# Altium project Hexapod_motherboard.PrjPcb
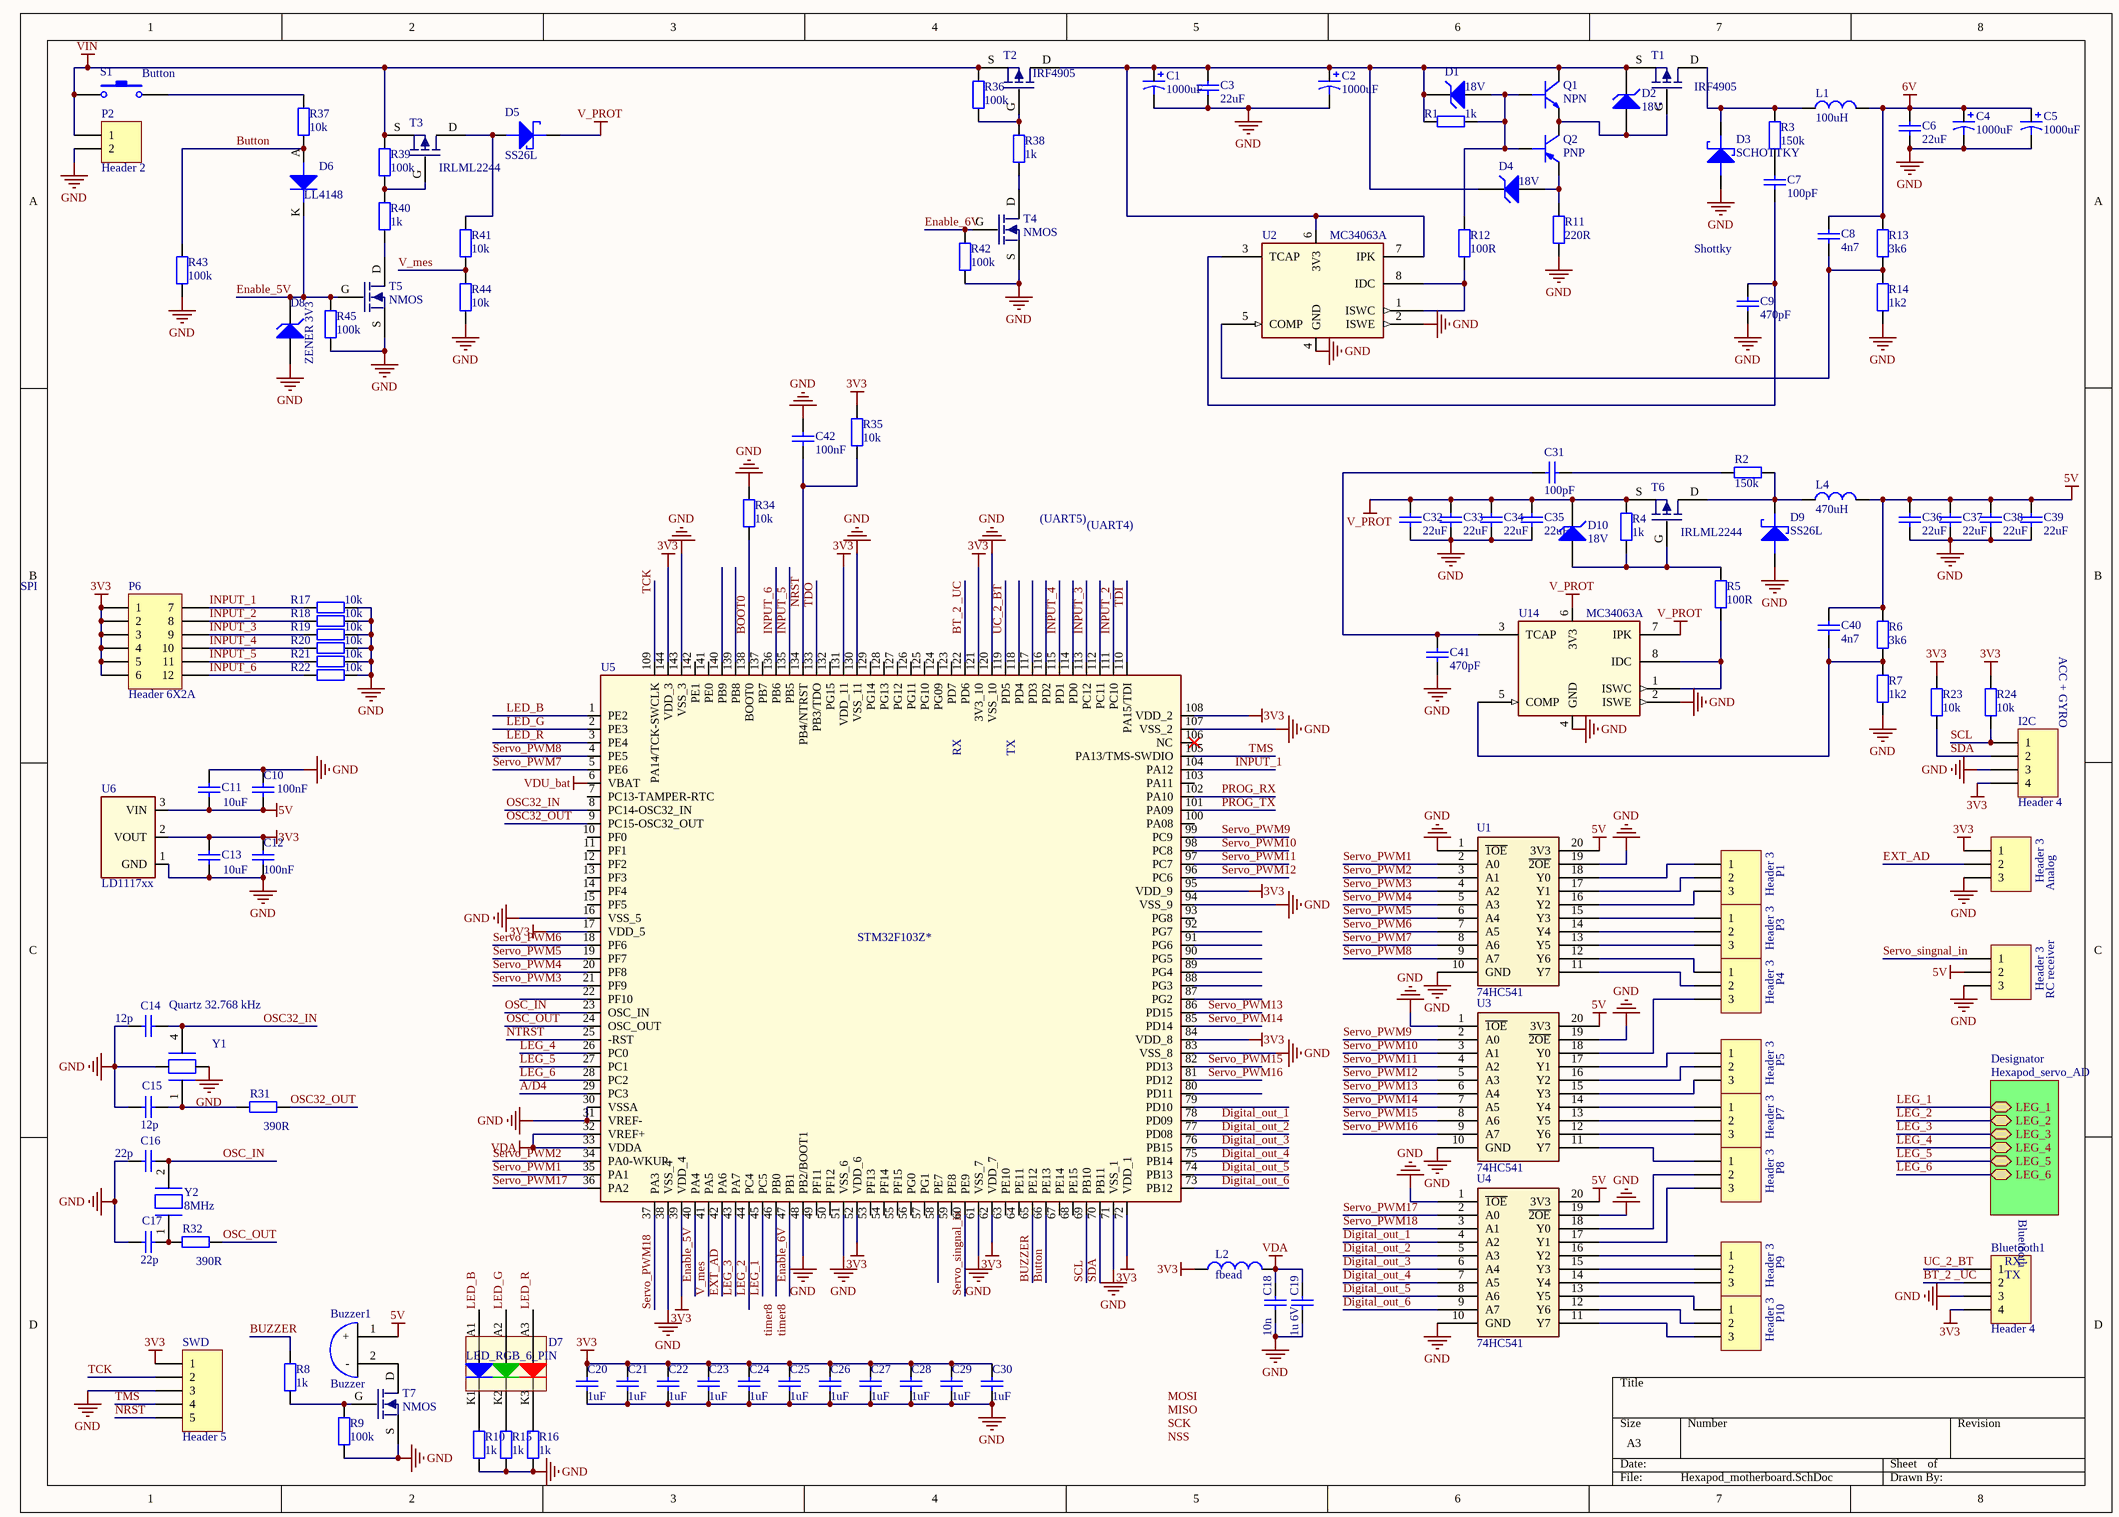
[diagram p0: Hexapod_motherboard.SchDoc]
2 sheets, 190 parts. Net scope: hierarchical (ports join the sheet entries above them; power ports are global).
Board file: Hexapod_motherboard.PcbDoc
Sheets:
  Hexapod_motherboard.SchDoc
    Designator = Hexapod_servo_AD.SchDoc

## Sheet Hexapod_motherboard.SchDoc
size A3

### Parts
Analog  Header 3  [HDR1X3]
Bluetooth1  Header 4  [HDR1X4]
Buzzer1  Buzzer  [SMD Buzzer]
C1  1000uF  [cap_10x12]
C2  1000uF  [cap_10x12]
C3  22uF  [FP_1210_CAP_N]
C4  1000uF  [cap_10x12]
C5  1000uF  [cap_10x12]
C6  22uF  [FP_1210_CAP_N]
C7  100pF  [FP_0603_CAP_080]
C8  4n7  [FP_0603_CAP_080]
C9  470pF  [FP_0603_CAP_080]
C10  100nF  [FP_0603_CAP_080]
C11  10uF  [FP_1206_CAP_085]
C12  100nF  [FP_0603_CAP_080]
C13  10uF  [FP_1206_CAP_085]
C14  12p  [FP_0603_CAP_080]
C15  12p  [FP_0603_CAP_080]
C16  22p  [FP_0603_CAP_080]
C17  22p  [FP_0603_CAP_080]
C18  10n  [FP_0603_CAP_080]
C19  1u 6V  [FP_0603_CAP_080]
C20  1uF  [FP_0603_CAP_080]
C21  1uF  [FP_0603_CAP_080]
C22  1uF  [FP_0603_CAP_080]
C23  1uF  [FP_0603_CAP_080]
C24  1uF  [FP_0603_CAP_080]
C25  1uF  [FP_0603_CAP_080]
C26  1uF  [FP_0603_CAP_080]
C27  1uF  [FP_0603_CAP_080]
C28  1uF  [FP_0603_CAP_080]
C29  1uF  [FP_0603_CAP_080]
C30  1uF  [FP_0603_CAP_080]
C31  100pF  [FP_0603_CAP_080]
C32  22uF  [C1210_N]
C33  22uF  [C1210_N]
C34  22uF  [C1210_N]
C35  22uF  [C1210_N]
C36  22uF  [C1210_N]
C37  22uF  [C1210_N]
C38  22uF  [C1210_N]
C39  22uF  [C1210_N]
C40  4n7  [FP_0603_CAP_080]
C41  470pF  [FP_0603_CAP_080]
C42  100nF  [FP_0603_CAP_080]
D1  18V  [SOD-80]
D2  18V  [SOD-80]
D3  SCHOTTKY  [DIODE_TO220]
D4  18V  [SOD-80]
D5  SS26L  [subsma]
D6  LL4148  [SOD-80]
D7  LED_RGB_6_PIN  [LED_PLCC-6]
D8  ZENER 3V3  [sod-80]
D9  SS26L  [subsma]
D10  18V  [SOD-80]
I2C  Header 4  [HDR1X4]
L1  100uH  [SRR1206_T]
L2  fbead  [FP_0603_IND]
L4  470uH  [INDUCTOR_6,6X6,6mm]
P1  Header 3  [HDR1X3]
P2  Header 2  [Sorkapocs 2P 5mm]
P3  Header 3  [HDR1X3]
P4  Header 3  [HDR1X3]
P5  Header 3  [HDR1X3]
P6  Header 6X2A  [HDR2X6_CEN]
P7  Header 3  [HDR1X3]
P8  Header 3  [HDR1X3]
P9  Header 3  [HDR1X3]
P10  Header 3  [HDR1X3]
Q1  NPN  [TR_SOT23]
Q2  PNP  [TR_SOT23]
R1  1k  [FP_1206_RES]
R2  150k  [FP_0603_RES]
R3  150k  [FP_0603_RES]
R4  1k  [FP_0603_RES]
R5  100R  [FP_0603_RES]
R6  3k6  [FP_0603_RES]
R7  1k2  [FP_0603_RES]
R8  1k  [FP_0603_RES]
R9  100k  [FP_0603_RES]
R10  1k  [FP_0603_RES]
R11  220R  [FP_1206_RES]
R12  100R  [FP_1206_RES]
R13  3k6  [FP_0603_RES]
R14  1k2  [FP_0603_RES]
R15  1k  [FP_0603_RES]
R16  1k  [FP_0603_RES]
R17  10k  [FP_0603_RES]
R18  10k  [FP_0603_RES]
R19  10k  [FP_0603_RES]
R20  10k  [FP_0603_RES]
R21  10k  [FP_0603_RES]
R22  10k  [FP_0603_RES]
R23  10k  [FP_0603_RES]
R24  10k  [FP_0603_RES]
R31  390R  [FP_0603_RES]
R32  390R  [FP_0603_RES]
R34  10k  [FP_0603_RES]
R35  10k  [FP_0603_RES]
R36  100k  [FP_0603_RES]
R37  10k  [FP_0603_RES]
R38  1k  [FP_0603_RES]
R39  100k  [FP_0603_RES]
R40  1k  [FP_0603_RES]
R41  10k  [FP_0603_RES]
R42  100k  [FP_0603_RES]
R43  100k  [FP_0603_RES]
R44  10k  [FP_0603_RES]
R45  100k  [FP_0603_RES]
RC_receiver  Header 3  [HDR1X3]
S1  Button  [BUTTON_6X6 _SMD]
SWD  Header 5  [HDR1X5]
T1  IRF4905  [FET_TO220]
T2  IRF4905  [FET_TO220]
T3  IRLML2244  [FET_SOT23]
T4  NMOS  [FET_SOT23]
T5  NMOS  [FET_SOT23]
T6  IRLML2244  [FET_SOT23]
T7  NMOS  [FET_SOT23]
U1  74HC541  [DIGITAL_SOIC20W]
U2  MC34063A  [FP_SO8_MS012AA]
U3  74HC541  [DIGITAL_SOIC20W]
U4  74HC541  [DIGITAL_SOIC20W]
U5  STM32F103Z*  [LQFP144]
U6  LD1117xx  [SUPPLY_SOT223]
U14  MC34063A  [FP_SO8_MS012AA]
Y1  Quartz 32.768 kHz  [XTAL_ABS25]
Y2  value 8MHz  [FP_CRYSTAL_HC49_SMD]  (hidden comment: 8MHz Quartz HC49)

### Sub-sheets
Designator = Hexapod_servo_AD: LEG_1, LEG_2, LEG_3, LEG_4, LEG_5, LEG_6

### Nets
3V3: Analog.1 Bluetooth1.4 C12.1 C13.2 C20.2 C21.2 C22.2 C23.2 C24.2 C25.2 C26.2 C27.2 C28.2 C29.2 C30.2 I2C.4 L2.1 P6.1 P6.2 P6.3 P6.4 P6.5 P6.6 R23.2 R24.2 R35.2 SWD.1 U5.17(VDD_5) U5.39(VDD_4) U5.52(VDD_6) U5.62(VDD_7) U5.72(VDD_1) U5.84(VDD_8) U5.95(VDD_9) U5.108(VDD_2) U5.121(3V3_10) U5.131(VDD_11) U5.144(VDD_3) U6.2(VOUT)
5V: Buzzer1.1(+) C10.2 C11.1 C36.2 C37.2 C38.2 C39.2 C40.2 L4.2 R6.2 RC_receiver.2 U1.20(3V3) U3.20(3V3) U4.20(3V3) U6.3(VIN)
6V: C4.P C5.P C6.2 C8.2 L1.2 R13.2
GND: Analog.3 Bluetooth1.3 C1.N C2.N C3.1 C4.N C5.N C6.1 C9.2 C10.1 C11.2 C12.2 C13.1 C14.1 C15.1 C16.1 C17.1 C18.1 C19.1 C20.1 C21.1 C22.1 C23.1 C24.1 C25.1 C26.1 C27.1 C28.1 C29.1 C30.1 C32.1 C33.1 C34.1 C35.1 C36.1 C37.1 C38.1 C39.1 C41.2 C42.2 D3.A D8.A D9.A I2C.3 P2.2 R7.1 R9.1 R10.2 R11.1 R14.1 R15.2 R16.2 R17.2 R18.2 R19.2 R20.2 R21.2 R22.2 R34.2 R42.1 R43.2 R44.2 R45.1 RC_receiver.3 SWD.3 T4.S T5.S T7.S U1.1(~{1OE}) U1.10(GND) U1.19(~{2OE}) U2.2(ISWE) U2.4(GND) U3.1(~{1OE}) U3.10(GND) U3.19(~{2OE}) U4.1(~{1OE}) U4.10(GND) U4.19(~{2OE}) U5.16(VSS_5) U5.30(VSSA) U5.31(VREF-) U5.38(VSS_4) U5.48(PB2/BOOT1) U5.51(VSS_6) U5.61(VSS_7) U5.71(VSS_1) U5.83(VSS_8) U5.94(VSS_9) U5.107(VSS_2) U5.120(VSS_10) U5.130(VSS_11) U5.143(VSS_3) U6.1(GND) U14.2(ISWE) U14.4(GND) Y1.2 Y1.3
V_PROT: C32.2 C33.2 C34.2 C35.2 D5.K D10.K R4.2 T6.S U14.6(3V3) U14.7(IPK)
VDA: C18.2 C19.2 L2.2 U5.32(VREF+) U5.33(VDDA)
VDU_bat: U5.6(VBAT)
VIN: P2.1 R36.2 R39.2 S1.1 T2.S T3.S
A/D4: U5.29(PC3)
BOOT0: R34.1 U5.138(BOOT0)
BT_2 _UC: Bluetooth1.2 U5.122(PD6)
Button: D6.A R37.2 R43.1 U5.66(PE13)
BUZZER: R8.1 U5.65(PE12)
Digital_out_1: U4.4(A2) U5.78(PD09)
Digital_out_2: U4.5(A3) U5.77(PD08)
Digital_out_3: U4.6(A4) U5.76(PB15)
Digital_out_4: U4.7(A5) U5.75(PB14)
Digital_out_5: U4.8(A6) U5.74(PB13)
Digital_out_6: U4.9(A7) U5.73(PB12)
Enable_5V: D6.K D8.K R45.2 T5.G U5.40(PA4)
Enable_6V: R42.2 T4.G U5.47(PB1)
EXT_AD: Analog.2 U5.42(PA6)
INPUT_1: P6.7 R17.1 U5.104(PA12)
INPUT_2: P6.8 R18.1 U5.111(PC10)
INPUT_3: P6.9 R19.1 U5.113(PC12)
INPUT_4: P6.10 R20.1 U5.115(PD1)
INPUT_5: P6.11 R21.1 U5.135(PB5)
INPUT_6: P6.12 R22.1 U5.136(PB6)
LED_B: D7.A1(A) U5.1(PE2)
LED_G: D7.A2(A) U5.2(PE3)
LED_R: D7.A3(A) U5.3(PE4)
LEG_1: U5.45(PC5) ; sheet Designator/LEG_1
LEG_2: U5.44(PC4) ; sheet Designator/LEG_2
LEG_3: U5.43(PA7) ; sheet Designator/LEG_3
LEG_4: U5.26(PC0) ; sheet Designator/LEG_4
LEG_5: U5.27(PC1) ; sheet Designator/LEG_5
LEG_6: U5.28(PC2) ; sheet Designator/LEG_6
NRST: C42.1 R35.1 SWD.5 U5.134(PB4/NTRST)
NTRST: U5.25(-RST)
OSC32_IN: C14.2 U5.8(PC14-OSC32_IN) Y1.4
OSC32_OUT: R31.1 U5.9(PC15-OSC32_OUT)
OSC_IN: C16.2 U5.23(OSC_IN) Y2.2
OSC_OUT: R32.1 U5.24(OSC_OUT)
PROG_RX: U5.102(PA10)
PROG_TX: U5.101(PA09)
SCL: I2C.1 R24.1 U5.69(PB10)
SDA: I2C.2 R23.1 U5.70(PB11)
Servo_PWM1: U1.2(A0) U5.35(PA1)
Servo_PWM2: U1.3(A1) U5.34(PA0-WKUP)
Servo_PWM3: U1.4(A2) U5.21(PF9)
Servo_PWM4: U1.5(A3) U5.20(PF8)
Servo_PWM5: U1.6(A4) U5.19(PF7)
Servo_PWM6: U1.7(A5) U5.18(PF6)
Servo_PWM7: U1.8(A6) U5.5(PE6)
Servo_PWM8: U1.9(A7) U5.4(PE5)
Servo_PWM9: U3.2(A0) U5.99(PC9)
Servo_PWM10: U3.3(A1) U5.98(PC8)
Servo_PWM11: U3.4(A2) U5.97(PC7)
Servo_PWM12: U3.5(A3) U5.96(PC6)
Servo_PWM13: U3.6(A4) U5.86(PD15)
Servo_PWM14: U3.7(A5) U5.85(PD14)
Servo_PWM15: U3.8(A6) U5.82(PD13)
Servo_PWM16: U3.9(A7) U5.81(PD12)
Servo_PWM17: U4.2(A0) U5.36(PA2)
Servo_PWM18: U4.3(A1) U5.37(PA3)
Servo_singnal_in: RC_receiver.1 U5.60(PE9)
TCK: SWD.2 U5.109(PA14/TCK-SWCLK)
TDI: U5.110(PA15/TDI)
TDO: U5.133(PB3/TDO)
TMS: SWD.4 U5.105(PA13/TMS-SWDIO)
UC_2_BT: Bluetooth1.1 U5.119(PD5)
V_mes: R41.2 R44.1 U5.41(PA5)
NetBuzzer1_2: Buzzer1.2(-) T7.D
NetC1_P: C1.P C2.P C3.2 D1.K D2.K D4.K Q1.C R1.2 T1.S T2.D U2.6(3V3) U2.7(IPK)
NetC7_1: C7.1 R3.2
NetC7_2: C7.2 C9.1 U2.3(TCAP)
NetC8_1: C8.1 R13.1 R14.2 U2.5(COMP)
NetC15_2: C15.2 R31.2 Y1.1
NetC17_2: C17.2 R32.2 Y2.1
NetC31_1: C31.1 R2.2
NetC31_2: C31.2 C41.1 U14.3(TCAP)
NetC40_1: C40.1 R6.1 R7.2 U14.5(COMP)
NetD1_A: D1.A Q1.B Q2.B R1.1 R12.2
NetD2_A: D2.A Q1.E Q2.C T1.G
NetD3_K: D3.K L1.1 R3.1 T1.D
NetD4_A: D4.A Q2.E R11.2
NetD5_A: D5.A R41.1 T3.D
NetD7_K1: D7.K1(R) R10.1
NetD7_K2: D7.K2(G) R15.1
NetD7_K3: D7.K3(B) R16.1
NetD9_K: D9.K L4.1 R2.1 T6.D
NetD10_A: D10.A R4.1 R5.2 T6.G
NetP1_1: P1.1 U1.18(Y0)
NetP1_2: P1.2 U1.17(Y1)
NetP1_3: P1.3 U1.16(Y2)
NetP3_1: P3.1 U1.15(Y3)
NetP3_2: P3.2 U1.14(Y4)
NetP3_3: P3.3 U1.13(Y5)
NetP4_1: P4.1 U1.12(Y6)
NetP4_2: P4.2 U1.11(Y7)
NetP4_3: P4.3 U3.18(Y0)
NetP5_1: P5.1 U3.17(Y1)
NetP5_2: P5.2 U3.16(Y2)
NetP5_3: P5.3 U3.15(Y3)
NetP7_1: P7.1 U3.14(Y4)
NetP7_2: P7.2 U3.13(Y5)
NetP7_3: P7.3 U3.12(Y6)
NetP8_1: P8.1 U3.11(Y7)
NetP8_2: P8.2 U4.18(Y0)
NetP8_3: P8.3 U4.17(Y1)
NetP9_1: P9.1 U4.16(Y2)
NetP9_2: P9.2 U4.15(Y3)
NetP9_3: P9.3 U4.14(Y4)
NetP10_1: P10.1 U4.13(Y5)
NetP10_2: P10.2 U4.12(Y6)
NetP10_3: P10.3 U4.11(Y7)
NetR5_1: R5.1 U14.1(ISWC) U14.8(IDC)
NetR8_2: R8.2 R9.2 T7.G
NetR12_1: R12.1 U2.1(ISWC) U2.8(IDC)
NetR36_1: R36.1 R38.2 T2.G
NetR37_1: R37.1 S1.2
NetR38_1: R38.1 T4.D
NetR39_1: R39.1 R40.1 T3.G
NetR40_2: R40.2 T5.D

Not connected (* = marked no-connect by the designer): U5 7(PC13-TAMPER-RTC) 10(PF0) 11(PF1) 12(PF2) 13(PF3) 14(PF4) 15(PF5) 22(PF10) 46(PB0) 49(PF11) 50(PF12) 53(PF13) 54(PF14) 55(PF15) 56(PG0) 57(PG1) 58(PE7) 59(PE8) 63(PE10) 64(PE11) 67(PE14) 68(PE15) 79(PD10) 80(PD11) 87(PG2) 88(PG3) 89(PG4) 90(PG5) 91(PG6) 92(PG7) 93(PG8) 100(PA08) 103(PA11) 106(NC)* 112(PC11) 114(PD0) 116(PD2) 117(PD3) 118(PD4) 123(PD7) 124(PG09) 125(PG10) 126(PG11) 127(PG12) 128(PG13) 129(PG14) 132(PG15) 137(PB7) 139(PB8) 140(PB9) 141(PE0) 142(PE1)

### Notes on the sheet
- Shottky
- (UART5)
- SPI
- (UART4)
- (near I2C) ACC + GYRO
- (near U5) RX
- (near U5) TX
- (near Bluetooth1) RX
- (near Bluetooth1) Bluetooth
- (near Bluetooth1) TX
- Labels drawn without touching a wire or pin: MISO, MOSI, NSS, SCK, timer8

### Library data of the parts
Analog P1 P3-P5 P7-P10 RC_receiver = Header 3: Header, 3-Pin; LatestRevisionDate: 17-Jul-2002; LatestRevisionNote: Re-released for DXP Platform.; Publisher: Altium Limited
Bluetooth1 I2C = Header 4: Header, 4-Pin; LatestRevisionDate: 17-Jul-2002; LatestRevisionNote: Re-released for DXP Platform.; Publisher: Altium Limited
C1 C2 C4 C5 = CAP_ELECT: Polarized Capacitor; Value: 1000uF
C3 C6 C32-C39 = CAP: Capacitor; Tûrés: 20% X7R; Value: 22uF; Order info: http://www.tme.eu/hu/details/cl32a226kojnnne/mlcc-smd-1210-kondenzatorok/samsung/
C7 C31 = Cap: Capacitor; Order info: L: 82-02-26; Tûrés: 10%; Published: 8-Jun-2000; LatestRevisionDate: 17-Jul-2002; LatestRevisionNote: Re-released for DXP Platform.; PackageReference: RAD-0.3; Publisher: Altium Limited; Value: 100pF
C8 C40 = Cap: Capacitor; Value: 100pF; Order info: TODO; Tûrés: 10%; Published: 8-Jun-2000; LatestRevisionDate: 17-Jul-2002; LatestRevisionNote: Re-released for DXP Platform.; PackageReference: RAD-0.3; Publisher: Altium Limited
C9 C41 = Cap: Capacitor; Value: 100pF; Tûrés: 10% NP0; Published: 8-Jun-2000; LatestRevisionDate: 17-Jul-2002; LatestRevisionNote: Re-released for DXP Platform.; PackageReference: RAD-0.3; Publisher: Altium Limited; Order info: 82-02-34
C10 C12 C14-C17 C42 = Cap: Capacitor; Order info: TODO; Tûrés: 10%; Published: 8-Jun-2000; LatestRevisionDate: 17-Jul-2002; LatestRevisionNote: Re-released for DXP Platform.; PackageReference: RAD-0.3; Publisher: Altium Limited
  C10 C12 C42: Value: 100nF
  C14 C15: Value: 12p
  C16 C17: Value: 22p
C11 C13 = Cap: Capacitor; Value: 100nF; Tûrés: 20% X7R; Order info: TODO; Published: 8-Jun-2000; LatestRevisionDate: 17-Jul-2002; LatestRevisionNote: Re-released for DXP Platform.; PackageReference: RAD-0.3; Publisher: Altium Limited; Order info: 82-07-81
C18 C19 = Cap: Capacitor; Value: 100nF; Published: 8-Jun-2000; LatestRevisionDate: 17-Jul-2002; LatestRevisionNote: Re-released for DXP Platform.; PackageReference: RAD-0.3; Publisher: Altium Limited
C20-C30 = Cap: Capacitor; Published: 8-Jun-2000; LatestRevisionDate: 17-Jul-2002; LatestRevisionNote: Re-released for DXP Platform.; PackageReference: RAD-0.3; Publisher: Altium Limited; Value: 1uF
D1 D2 D4 D10 = ZENER: Zener Diode; U_Z: 24; Order info: L: 85-01-29
D3 = SCHOTTKY: NXP - PMEG3020EJ,115 - SCHOTTKY RECT 30V 2A SOD323F; Supplier: Farnell 1757772
D5 D9 = SCHOTTKY: NXP - PMEG3020EJ,115 - SCHOTTKY RECT 30V 2A SOD323F; Order info: L: 83-02-21
D6 = DIODE_big
D8 = ZENER: Zener Diode; U_Z: 24
L1 L4 = L: Order info: RET: 77-01-48  // lomex: 93-03-38
L2 = Inductor: Code_IEC: 1005; Published: 8-Jun-2000; LatestRevisionDate: 17-Jul-2002; LatestRevisionNote: Re-released for DXP Platform.; PackageReference: 0402-A; Publisher: Altium Limited; Code_JEITA: 0402; Value: FBEAD
P2 = Header 2: Header, 2-Pin; LatestRevisionDate: 17-Jul-2002; LatestRevisionNote: Re-released for DXP Platform.; Publisher: Altium Limited
P6 = Header 6X2A: Header, 6-Pin, Dual row; LatestRevisionDate: 17-Jul-2002; LatestRevisionNote: Re-released for DXP Platform.; Publisher: Altium Limited
R1 R4 = Res3: Resistor; Order info: TODO; Tûrés: 5%; Published: 8-Jun-2000; LatestRevisionDate: 04-Mar-2005; LatestRevisionNote: PCB Footprint replaced.; PackageReference: J1-0603; Publisher: Altium Limited; Value: 1k
R2 R3 R5 R11 R12 R34 R35 = Res3: Resistor; Value: 1k; Order info: TODO; Tûrés: 5%; Published: 8-Jun-2000; LatestRevisionDate: 04-Mar-2005; LatestRevisionNote: PCB Footprint replaced.; PackageReference: J1-0603; Publisher: Altium Limited
R6 R7 R13 R14 R23 R24 = Res3: Resistor; Value: 1k; Tûrés: 1%; Published: 8-Jun-2000; LatestRevisionDate: 04-Mar-2005; LatestRevisionNote: PCB Footprint replaced.; PackageReference: J1-0603; Publisher: Altium Limited
  R6 R13: Order info: 80-14-47
  R7 R14 R23 R24: Order info: 80-13-54
R8 R10 R15 R16 R38 R40 = Res3: Resistor; Published: 8-Jun-2000; LatestRevisionDate: 04-Mar-2005; LatestRevisionNote: PCB Footprint replaced.; PackageReference: J1-0603; Publisher: Altium Limited; Value: 1k
R9 R17-R22 R36 R37 R39 R41-R45 = Res3: Resistor; Value: 1k; Published: 8-Jun-2000; LatestRevisionDate: 04-Mar-2005; LatestRevisionNote: PCB Footprint replaced.; PackageReference: J1-0603; Publisher: Altium Limited
R31 R32 = Res3: Resistor; Value: 390; Order info: TODO; Tûrés: 5%; Published: 8-Jun-2000; LatestRevisionDate: 04-Mar-2005; LatestRevisionNote: PCB Footprint replaced.; PackageReference: J1-0603; Publisher: Altium Limited
S1 = SW-PB: Switch; Published: 24-Mar-1999; LatestRevisionDate: 17-Jul-2002; LatestRevisionNote: Re-released for DXP Platform.; PackageReference: SPST-2; Publisher: Altium Limited; Order info: http://www.tme.eu/hu/details/tactm-67n-f/tact-pcb-mikrokapcsolok/ninigi/#
SWD = Header 5: Header, 5-Pin; LatestRevisionDate: 17-Jul-2002; LatestRevisionNote: Re-released for DXP Platform.; Publisher: Altium Limited
T1 T2 = PMOS: Order info: mouser: 512-NDT2955
T3 T6 = PMOS
U1 U3 U4 = 74HC541: Octal buffer 3-state line driver
U2 U14 = MC34063A: Order info: mouser: 595-MC34063ADR
U5 = STM32F103Zxxx
U6 = LD1117xx: LD1117xx 3,3V lin reg; Order info: TODO; Order info: http://hu.mouser.com/ProductDetail/NXP/NX1117C33Z115/?qs=%2fha2pyFadui8%252bOpsKr9N%2fhvfdxjCMx%252bF0NTwqG%252bWOJY%3d
Y1 = XTAL_32,768khz ABS25 SMD: Order info: ugyanaz mint a feden
Y2 = XTAL HC49: Standard HC49 quartz; Manufacturer: Siward; Order info: ugyanaz mint a feden
Buzzer1 = Buzzer: Order info: http://www.digikey.com/product-detail/en/CD-1206-SMT/102-1150-ND/412409; Comment_1: Buzzer
D7 = LED_RGB_6_PIN: Order info: http://it.mouser.com/ProductDetail/OSRAM-Opto-Semiconductors/LRTBGFTM-ST7-1+VV9-29+Q5R/?qs=sGAEpiMZZMvyj6n1w4pZD%2ffl%252b8TIkxpNpOowvvOydA0%3d

## Sheet Hexapod_servo_AD.SchDoc
size A4
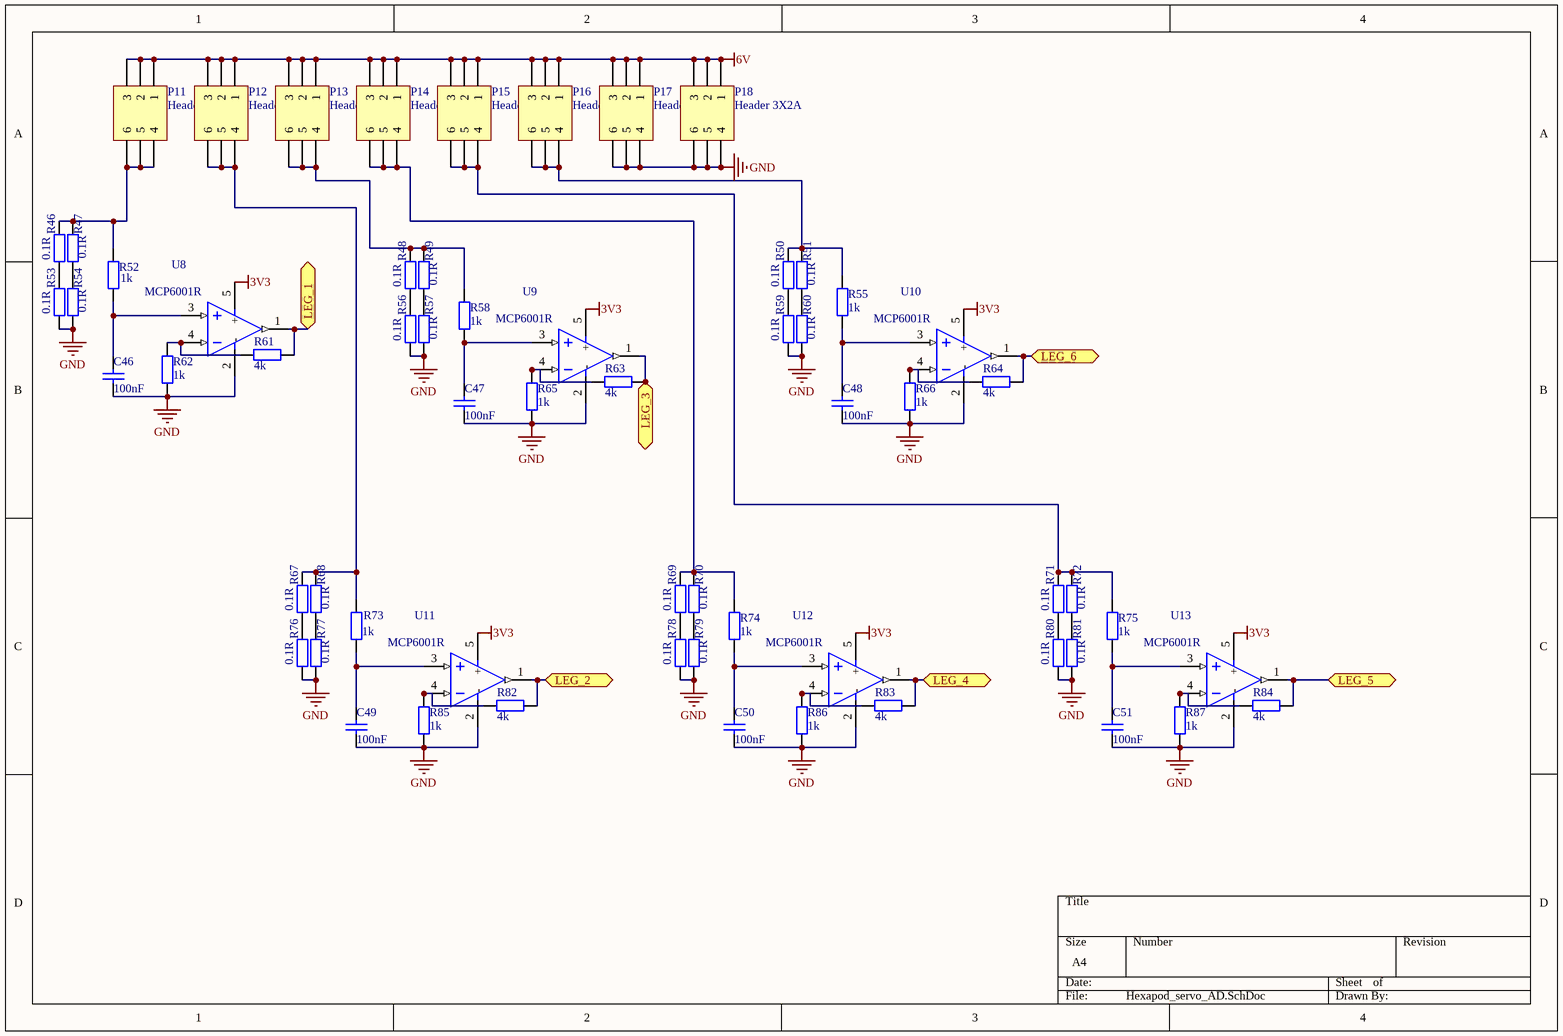
[diagram p1: Hexapod_servo_AD.SchDoc]

### Parts
C46  100nF  [FP_0603_CAP_080]
C47  100nF  [FP_0603_CAP_080]
C48  100nF  [FP_0603_CAP_080]
C49  100nF  [FP_0603_CAP_080]
C50  100nF  [FP_0603_CAP_080]
C51  100nF  [FP_0603_CAP_080]
P11  Header 3X2A  [HDR2X3_CEN]
P12  Header 3X2A  [HDR2X3_CEN]
P13  Header 3X2A  [HDR2X3_CEN]
P14  Header 3X2A  [HDR2X3_CEN]
P15  Header 3X2A  [HDR2X3_CEN]
P16  Header 3X2A  [HDR2X3_CEN]
P17  Header 3X2A  [HDR2X3_CEN]
P18  Header 3X2A  [HDR2X3_CEN]
R46  0.1R  [FP_0603_RES]
R47  0.1R  [FP_0603_RES]
R48  0.1R  [FP_0603_RES]
R49  0.1R  [FP_0603_RES]
R50  0.1R  [FP_0603_RES]
R51  0.1R  [FP_0603_RES]
R52  1k  [FP_0603_RES]
R53  0.1R  [FP_0603_RES]
R54  0.1R  [FP_0603_RES]
R55  1k  [FP_0603_RES]
R56  0.1R  [FP_0603_RES]
R57  0.1R  [FP_0603_RES]
R58  1k  [FP_0603_RES]
R59  0.1R  [FP_0603_RES]
R60  0.1R  [FP_0603_RES]
R61  4k  [FP_0603_RES]
R62  1k  [FP_0603_RES]
R63  4k  [FP_0603_RES]
R64  4k  [FP_0603_RES]
R65  1k  [FP_0603_RES]
R66  1k  [FP_0603_RES]
R67  0.1R  [FP_0603_RES]
R68  0.1R  [FP_0603_RES]
R69  0.1R  [FP_0603_RES]
R70  0.1R  [FP_0603_RES]
R71  0.1R  [FP_0603_RES]
R72  0.1R  [FP_0603_RES]
R73  1k  [FP_0603_RES]
R74  1k  [FP_0603_RES]
R75  1k  [FP_0603_RES]
R76  0.1R  [FP_0603_RES]
R77  0.1R  [FP_0603_RES]
R78  0.1R  [FP_0603_RES]
R79  0.1R  [FP_0603_RES]
R80  0.1R  [FP_0603_RES]
R81  0.1R  [FP_0603_RES]
R82  4k  [FP_0603_RES]
R83  4k  [FP_0603_RES]
R84  4k  [FP_0603_RES]
R85  1k  [FP_0603_RES]
R86  1k  [FP_0603_RES]
R87  1k  [FP_0603_RES]
U8  MCP6001R  [ANALOG_SOT23-5]
U9  MCP6001R  [ANALOG_SOT23-5]
U10  MCP6001R  [ANALOG_SOT23-5]
U11  MCP6001R  [ANALOG_SOT23-5]
U12  MCP6001R  [ANALOG_SOT23-5]
U13  MCP6001R  [ANALOG_SOT23-5]

### Ports
LEG_1, LEG_2, LEG_3, LEG_4, LEG_5, LEG_6

### Nets
3V3: U8.5(+) U9.5(+) U10.5(+) U11.5(+) U12.5(+) U13.5(+)
6V: P11.1 P11.2 P11.3 P12.1 P12.2 P12.3 P13.1 P13.2 P13.3 P14.1 P14.2 P14.3 P15.1 P15.2 P15.3 P16.1 P16.2 P16.3 P17.1 P17.2 P17.3 P18.1 P18.2 P18.3
GND: C46.1 C47.1 C48.1 C49.1 C50.1 C51.1 P17.4 P17.5 P17.6 P18.4 P18.5 P18.6 R53.1 R54.1 R56.1 R57.1 R59.1 R60.1 R62.1 R65.1 R66.1 R76.1 R77.1 R78.1 R79.1 R80.1 R81.1 R85.1 R86.1 R87.1 U8.2(-) U9.2(-) U10.2(-) U11.2(-) U12.2(-) U13.2(-)
LEG_1: R61.2 U8.1(OUT1) ; port LEG_1
LEG_2: R82.2 U11.1(OUT1) ; port LEG_2
LEG_3: R63.2 U9.1(OUT1) ; port LEG_3
LEG_4: R83.2 U12.1(OUT1) ; port LEG_4
LEG_5: R84.2 U13.1(OUT1) ; port LEG_5
LEG_6: R64.2 U10.1(OUT1) ; port LEG_6
NetC46_2: C46.2 R52.1 U8.3(IN1+)
NetC47_2: C47.2 R58.1 U9.3(IN1+)
NetC48_2: C48.2 R55.1 U10.3(IN1+)
NetC49_2: C49.2 R73.1 U11.3(IN1+)
NetC50_2: C50.2 R74.1 U12.3(IN1+)
NetC51_2: C51.2 R75.1 U13.3(IN1+)
NetP11_4: P11.4 P11.5 P11.6 R46.2 R47.2 R52.2
NetP12_4: P12.4 P12.5 P12.6 R67.2 R68.2 R73.2
NetP13_4: P13.4 P13.5 P13.6 R48.2 R49.2 R58.2
NetP14_4: P14.4 P14.5 P14.6 R69.2 R70.2 R74.2
NetP15_4: P15.4 P15.5 P15.6 R71.2 R72.2 R75.2
NetP16_4: P16.4 P16.5 P16.6 R50.2 R51.2 R55.2
NetR46_1: R46.1 R53.2
NetR47_1: R47.1 R54.2
NetR48_1: R48.1 R56.2
NetR49_1: R49.1 R57.2
NetR50_1: R50.1 R59.2
NetR51_1: R51.1 R60.2
NetR61_1: R61.1 R62.2 U8.4(IN1-)
NetR63_1: R63.1 R65.2 U9.4(IN1-)
NetR64_1: R64.1 R66.2 U10.4(IN1-)
NetR67_1: R67.1 R76.2
NetR68_1: R68.1 R77.2
NetR69_1: R69.1 R78.2
NetR70_1: R70.1 R79.2
NetR71_1: R71.1 R80.2
NetR72_1: R72.1 R81.2
NetR82_1: R82.1 R85.2 U11.4(IN1-)
NetR83_1: R83.1 R86.2 U12.4(IN1-)
NetR84_1: R84.1 R87.2 U13.4(IN1-)

### Library data of the parts
C46-C51 = Cap: Capacitor; Value: 100pF; Published: 8-Jun-2000; LatestRevisionDate: 17-Jul-2002; LatestRevisionNote: Re-released for DXP Platform.; PackageReference: RAD-0.3; Publisher: Altium Limited
P11-P18 = Header 3X2A: Header, 3-Pin, Dual row; LatestRevisionDate: 17-Jul-2002; LatestRevisionNote: Re-released for DXP Platform.; Publisher: Altium Limited
R46-R51 R53 R54 R56 R57 R59-R61 R63 R64 R67-R72 R76-R84 = Res3: Resistor; Value: 1k; Published: 8-Jun-2000; LatestRevisionDate: 04-Mar-2005; LatestRevisionNote: PCB Footprint replaced.; PackageReference: J1-0603; Publisher: Altium Limited
R52 R55 R58 R62 R65 R66 R73-R75 R85-R87 = Res3: Resistor; Published: 8-Jun-2000; LatestRevisionDate: 04-Mar-2005; LatestRevisionNote: PCB Footprint replaced.; PackageReference: J1-0603; Publisher: Altium Limited; Value: 1k

## Nets that join several sheets
3V3: Hexapod_motherboard (39 pins), Hexapod_servo_AD (6 pins)
6V: Hexapod_motherboard (6 pins), Hexapod_servo_AD (24 pins)
GND: Hexapod_motherboard (98 pins), Hexapod_servo_AD (36 pins)
LEG_1: Hexapod_motherboard (U5.45), Hexapod_servo_AD (R61.2 U8.1)
LEG_2: Hexapod_motherboard (U5.44), Hexapod_servo_AD (R82.2 U11.1)
LEG_3: Hexapod_motherboard (U5.43), Hexapod_servo_AD (R63.2 U9.1)
LEG_4: Hexapod_motherboard (U5.26), Hexapod_servo_AD (R83.2 U12.1)
LEG_5: Hexapod_motherboard (U5.27), Hexapod_servo_AD (R84.2 U13.1)
LEG_6: Hexapod_motherboard (U5.28), Hexapod_servo_AD (R64.2 U10.1)